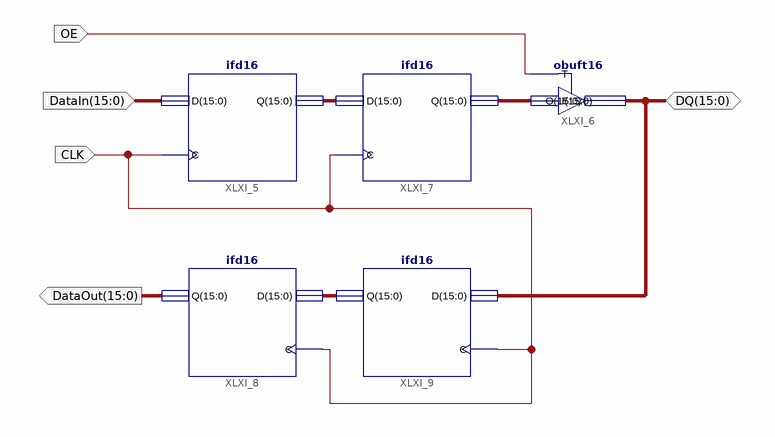
[diagram p0: schematic sheet 1]
// Xilinx ISE schematic DDR_SDRAM_Controller_Datapath.sch (spartan3e) as structural Verilog: 5 symbols, 5 ports
module DDR_SDRAM_Controller_Datapath (
  input  CLK,
  input  [15:0] DataIn,
  input  OE,
  inout  [15:0] DQ,
  output [15:0] DataOut
);

  wire [15:0] XLXN_2, XLXN_3, XLXN_4;

  ifd16 XLXI_5 (.C(CLK), .D(DataIn), .Q(XLXN_2));
  obuft16 XLXI_6 (.I(XLXN_4), .T(OE), .O(DQ));
  ifd16 XLXI_7 (.C(CLK), .D(XLXN_2), .Q(XLXN_4));
  ifd16 XLXI_8 (.C(CLK), .D(XLXN_3), .Q(DataOut));
  ifd16 XLXI_9 (.C(CLK), .D(DQ), .Q(XLXN_3));
endmodule
